# EAGLE design VGA Breakout Board (EAGLE 9.2.2)
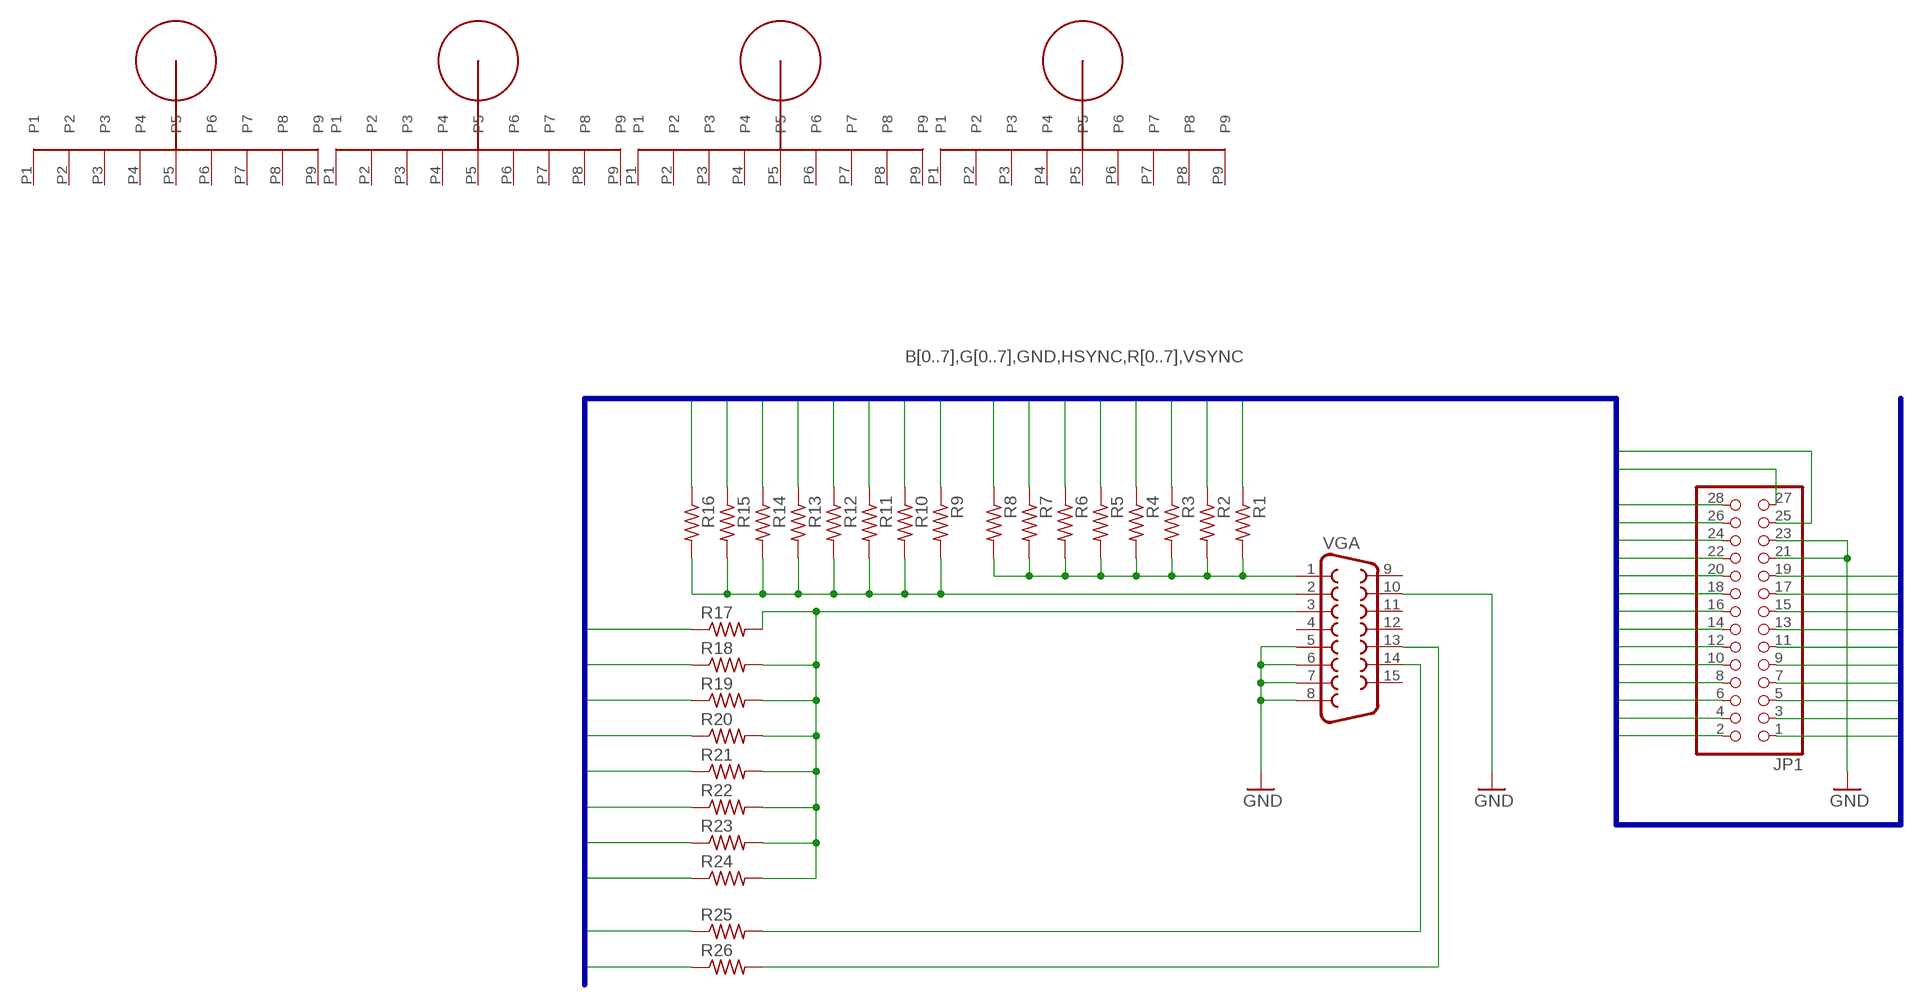
[diagram p0: schematic, sheet 1]

## Parts
JP1  PINHD-2X14  [2X14]
R1  R-US_0207/10  [0207/10]
R2  R-US_0207/10  [0207/10]
R3  R-US_0207/10  [0207/10]
R4  R-US_0207/10  [0207/10]
R5  R-US_0207/10  [0207/10]
R6  R-US_0207/10  [0207/10]
R7  R-US_0207/10  [0207/10]
R8  R-US_0207/10  [0207/10]
R9  R-US_0207/10  [0207/10]
R10  R-US_0207/10  [0207/10]
R11  R-US_0207/10  [0207/10]
R12  R-US_0207/10  [0207/10]
R13  R-US_0207/10  [0207/10]
R14  R-US_0207/10  [0207/10]
R15  R-US_0207/10  [0207/10]
R16  R-US_0207/10  [0207/10]
R17  R-US_0207/10  [0207/10]
R18  R-US_0207/10  [0207/10]
R19  R-US_0207/10  [0207/10]
R20  R-US_0207/10  [0207/10]
R21  R-US_0207/10  [0207/10]
R22  R-US_0207/10  [0207/10]
R23  R-US_0207/10  [0207/10]
R24  R-US_0207/10  [0207/10]
R25  R-US_0207/10  [0207/10]
R26  R-US_0207/10  [0207/10]
U$1  STANDOFF  [STANDOFF]
U$2  STANDOFF  [STANDOFF]
U$3  STANDOFF  [STANDOFF]
U$4  STANDOFF  [STANDOFF]
VGA  F15HDH  [HDF15H]

## Nets
B0: JP1.18 R17.1
B1: JP1.20 R18.1
B2: JP1.22 R19.1
B3: JP1.24 R20.1
B4: JP1.26 R21.1
B5: JP1.28 R22.1
B6: JP1.27 R23.1
B7: JP1.25 R24.1
G0: JP1.1 R9.1
G1: JP1.3 R10.1
G2: JP1.5 R11.1
G3: JP1.7 R12.1
G4: JP1.9 R13.1
G5: JP1.11 R14.1
G6: JP1.13 R15.1
G7: JP1.15 R16.1
GND: JP1.21 JP1.23 VGA.5 VGA.6 VGA.7 VGA.8 VGA.10
HSYNC: JP1.17 R26.1
N$1: R1.2 R2.2 R3.2 R4.2 R5.2 R6.2 R7.2 R8.2 VGA.1
N$2: R9.2 R10.2 R11.2 R12.2 R13.2 R14.2 R15.2 R16.2 VGA.2
N$3: R17.2 R18.2 R19.2 R20.2 R21.2 R22.2 R23.2 R24.2 VGA.3
N$4: R25.2 VGA.14
N$5: R26.2 VGA.13
R0: JP1.16 R1.1
R1: JP1.14 R2.1
R2: JP1.12 R3.1
R3: JP1.10 R4.1
R4: JP1.8 R5.1
R5: JP1.6 R6.1
R6: JP1.4 R7.1
R7: JP1.2 R8.1
VSYNC: JP1.19 R25.1
Unconnected: U$1.P1 U$1.P2 U$1.P3 U$1.P4 U$1.P5 U$1.P6 U$1.P7 U$1.P8 U$1.P9 U$2.P1 U$2.P2 U$2.P3 U$2.P4 U$2.P5 U$2.P6 U$2.P7 U$2.P8 U$2.P9 U$3.P1 U$3.P2 U$3.P3 U$3.P4 U$3.P5 U$3.P6 U$3.P7 U$3.P8 U$3.P9 U$4.P1 U$4.P2 U$4.P3 U$4.P4 U$4.P5 U$4.P6 U$4.P7 U$4.P8 U$4.P9 VGA.4 VGA.9 VGA.11 VGA.12 VGA.15

## Buses
B[0..7],G[0..7],GND,HSYNC,R[0..7],VSYNC

## Library data of the parts
JP1 = adafruit:PINHD-2X14: PIN HEADER
R1-R26 = adafruit:R-US_: RESISTOR, American symbol
U$1-U$4 = standoff:STANDOFF
VGA = adafruit:F15: SUB-D HDH is also known as a 'right angle VGA' connector

## Board
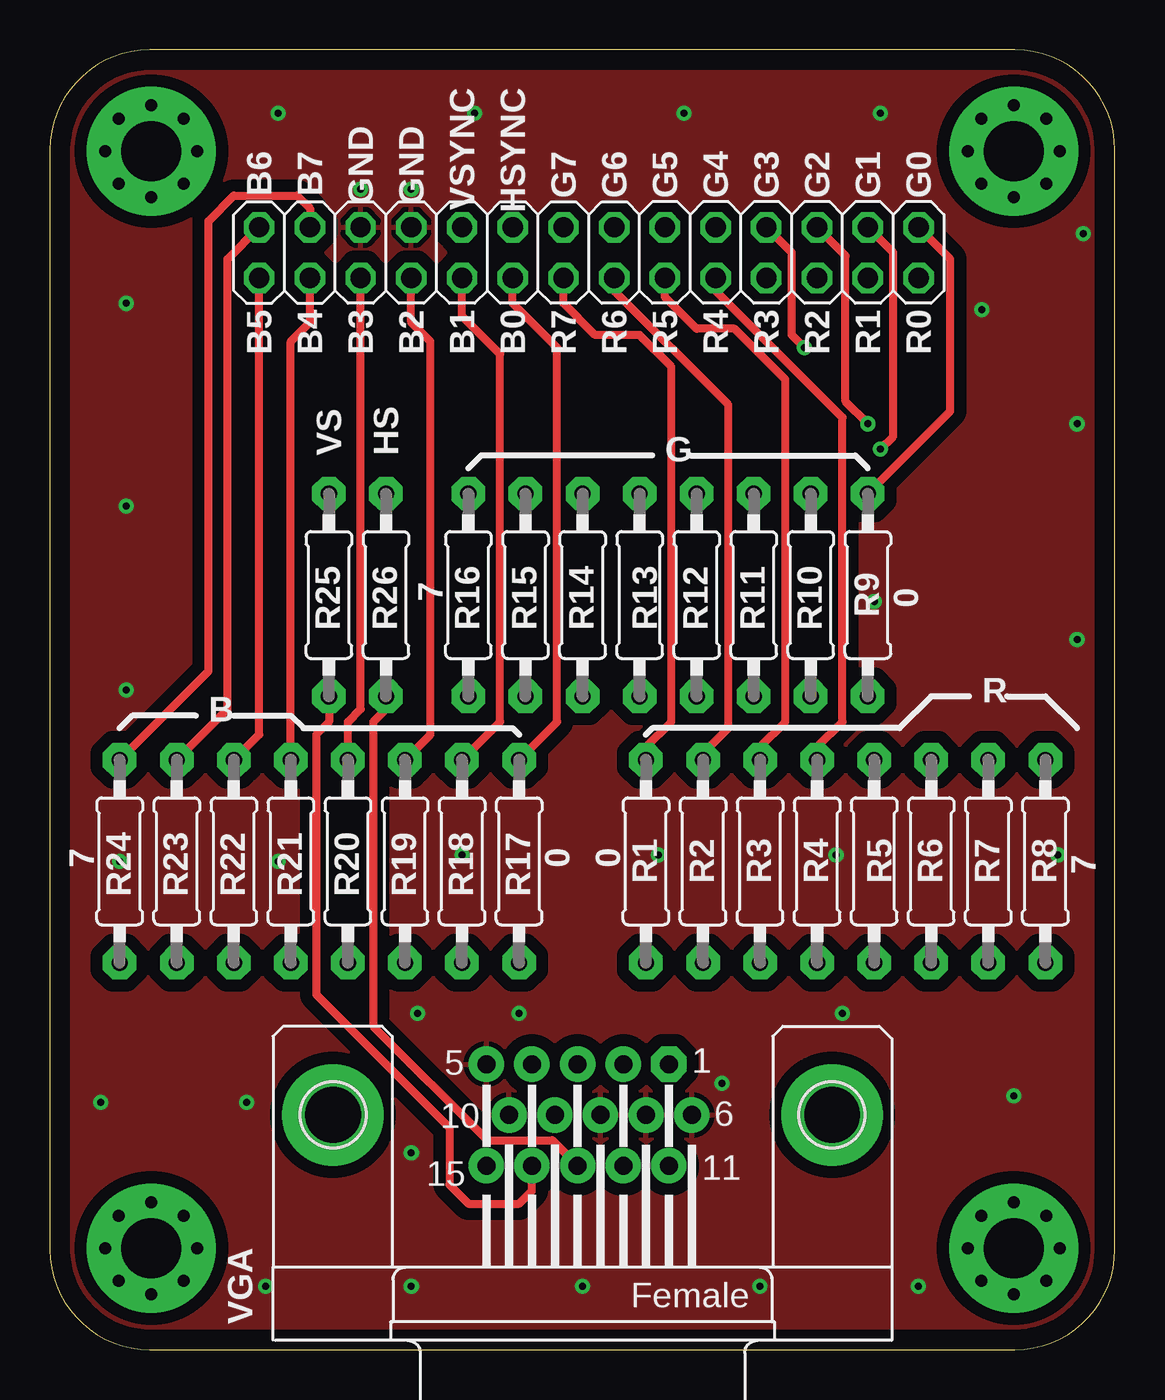
[diagram p1: board, top side]
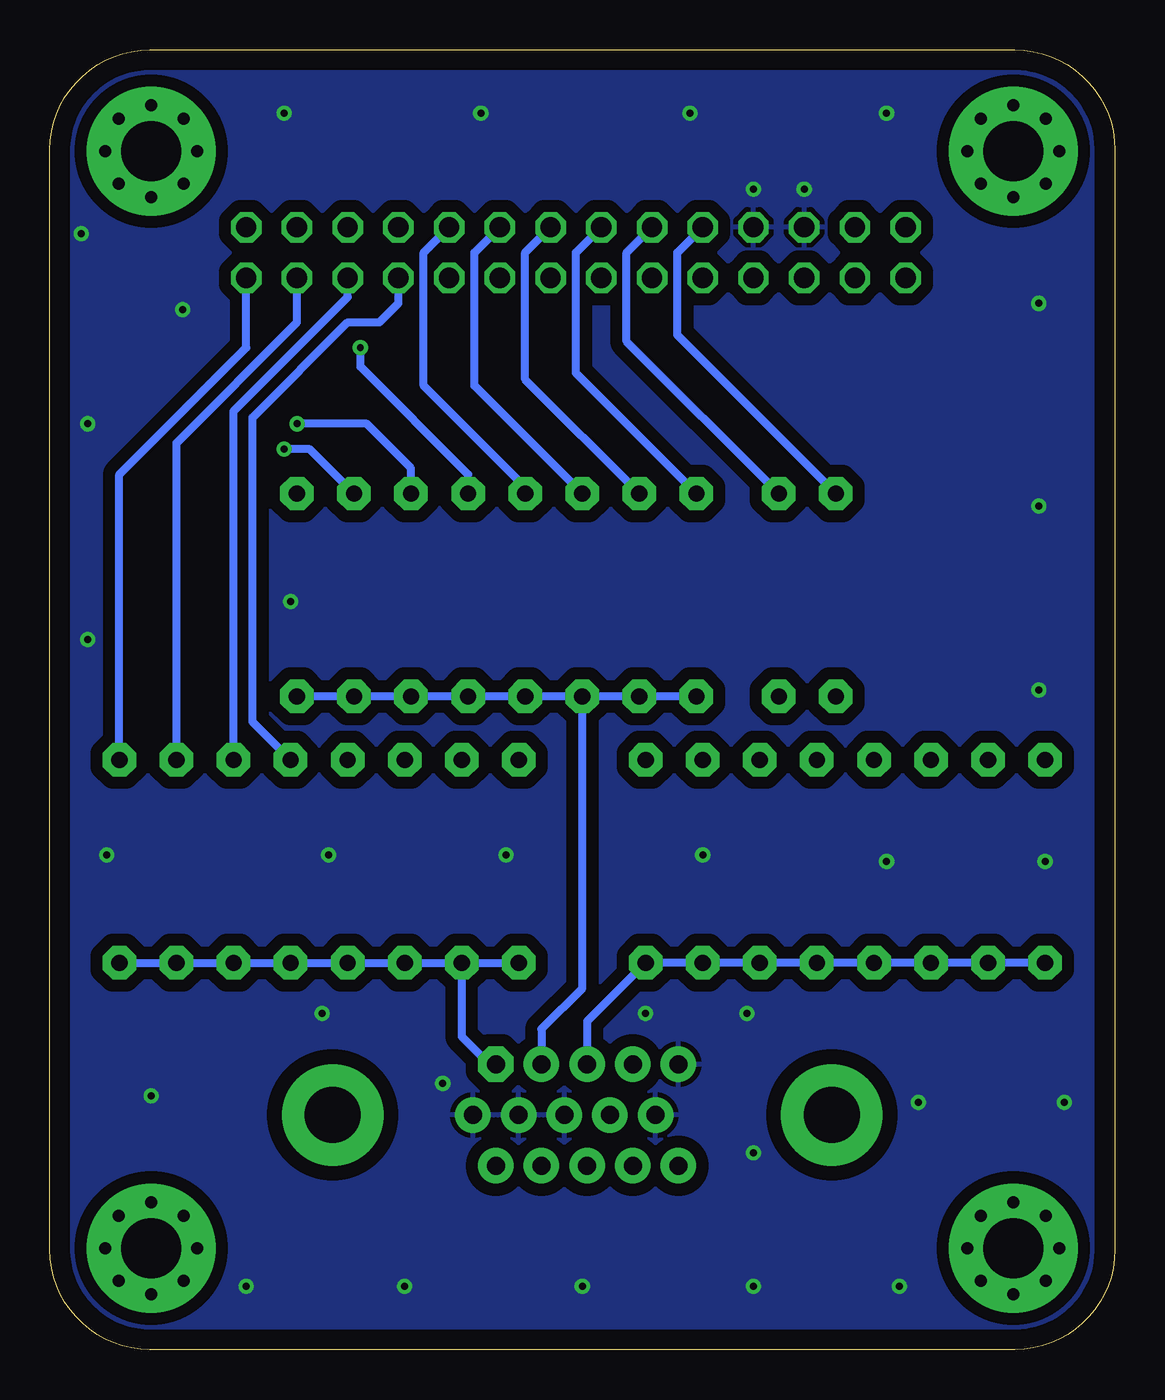
[diagram p2: board, bottom side, seen from below]

Size 53.33 x 65.08 mm. Coordinates in mm from the lower left corner, seen from the top.
Outline: 53.33,5 53.33,60.08 arc90 48.33,65.08 5,65.08 arc90 0,60.08 0,5 arc90 5,0 48.33,0 arc90 53.33,5
Copper layers (1*16): Top 0.035mm / dielectric 1.5mm / Bottom 0.035mm
Design rules "default *": minimum track width 6mil, minimum drill 0.35mm, track to track 6mil, track to pad 6mil, pad to pad 6mil, via to via 6mil, smd to smd 6mil, copper to edge 40mil, drill to drill 6mil, minimum pad ring 10mil, minimum via ring 8mil, stop-mask expansion 4mil, vias tented up to drill 14mil, thermal gap 10mil

### Footprints (pad centres in the part's own frame; a part is rotated, then mirrored left to right if it is on the bottom)
2X14 = drill 1.016 octagon: 1 -16.51,-1.27; 2 -16.51,1.27; 3 -13.97,-1.27; 4 -13.97,1.27; 5 -11.43,-1.27; 6 -11.43,1.27; 7 -8.89,-1.27; 8 -8.89,1.27; 9 -6.35,-1.27; 10 -6.35,1.27; 11 -3.81,-1.27; 12 -3.81,1.27; 13 -1.27,-1.27; 14 -1.27,1.27; 15 1.27,-1.27; 16 1.27,1.27; 17 3.81,-1.27; 18 3.81,1.27; 19 6.35,-1.27; 20 6.35,1.27; 21 8.89,-1.27; 22 8.89,1.27; 23 11.43,-1.27; 24 11.43,1.27; 25 13.97,-1.27; 26 13.97,1.27; 27 16.51,-1.27; 28 16.51,1.27
0207/10 = drill 0.813 pad 1.676 octagon: 1 -5.08,0; 2 5.08,0
STANDOFF = drill 3 pad 6.452: P1 0,0 | drill 0.6: P2 2.3,0; P3 1.626,1.626; P4 0,2.3; P5 -1.626,1.626; P6 -2.3,0; P7 -1.626,-1.626; P8 0,-2.3; P9 1.626,-1.626
HDF15H = drill 0.9 pad 1.778 octagon: 1 4.329,2.54 | drill 0.9 pad 1.778: 2 2.043,2.54; 3 -0.243,2.54; 4 -2.529,2.54; 5 -4.815,2.54; 6 5.472,0; 7 3.186,0; 8 0.9,0; 9 -1.386,0; 10 -3.672,0; 11 4.329,-2.54; 12 2.043,-2.54; 13 -0.243,-2.54; 14 -2.529,-2.54; 15 -4.815,-2.54 | drill 2.8 pad 5.08: P$1 -12.5,0; P$2 12.5,0

### Placement (x,y rotation side)
JP1  26.99,54.93 180 top
R1  29.84,24.45 270 top
R2  32.7,24.45 270 top
R3  35.56,24.45 270 top
R4  38.42,24.45 270 top
R5  41.27,24.45 270 top
R6  44.13,24.45 270 top
R7  46.99,24.45 270 top
R8  49.85,24.45 270 top
R9  40.96,37.78 270 top
R10  38.1,37.78 270 top
R11  35.24,37.78 270 top
R12  32.38,37.78 270 top
R13  29.53,37.78 270 top
R14  26.67,37.78 270 top
R15  23.81,37.78 270 top
R16  20.95,37.78 270 top
R17  23.5,24.45 270 top
R18  20.64,24.45 270 top
R19  17.78,24.45 270 top
R20  14.92,24.45 270 top
R21  12.06,24.45 270 top
R22  9.21,24.45 270 top
R23  6.35,24.45 270 top
R24  3.49,24.45 270 top
R25  13.97,37.78 270 top
R26  16.83,37.78 270 top
U$1  5.08,5.08 0 top
U$2  48.26,5.08 0 top
U$3  48.26,60.01 0 top
U$4  5.08,60.01 0 top
VGA  26.67,11.75 0 top

### Tracks (layer width: path | path; a pad name or v marks a point on that pad's centre or on a via)
B0
  Top 0.406: R17.1 25.4,31.43 25.4,50.16 23.18,52.39 JP1.18
B1
  Top 0.406: R18.1 22.54,31.43 22.54,49.85 20.64,51.75 JP1.20
B2
  Top 0.406: R19.1 19.05,30.8 19.05,50.48 18.1,51.44 JP1.22
B3
  Top 0.406: R20.1 14.92,31.43 15.56,32.07 JP1.24
B4
  Top 0.406: R21.1 12.06,50.48 13.02,51.44 JP1.26
B5
  Top 0.406: R22.1 10.48,30.8 JP1.28
B6
  Top 0.406: R23.1 8.89,32.07 8.89,54.61 JP1.27
B7
  Top 0.406: R24.1 7.94,33.97 7.94,56.52 9.21,57.78 12.38,57.78 13.02,57.15 JP1.25
G0
  Top 0.406: R9.1 45.09,46.99 45.09,54.61 JP1.1
G1  (via drill 0.35)
  Top 0.406: v41.59,45.09 42.23,45.72 42.23,54.93 JP1.3
  Bottom 0.406: R10.1 40.32,45.09 v41.59,45.09
G2  (via drill 0.35)
  Top 0.406: v40.96,46.35 39.84,47.47 39.84,54.77 JP1.5
  Bottom 0.406: R11.1 35.24,44.13 37.47,46.35 v40.96,46.35
G3  (via drill 0.35)
  Top 0.406: v37.78,50.16 37.15,50.8 37.15,54.93 JP1.7
  Bottom 0.406: R12.1 32.38,43.81 37.78,49.21 v37.78,50.16
G4
  Bottom 0.406: R13.1 29.53,43.18 34.61,48.26 34.61,54.93 JP1.9
G5
  Bottom 0.406: R14.1 32.07,48.26 32.07,54.93 JP1.11
G6
  Bottom 0.406: R15.1 29.53,48.58 29.53,54.93 JP1.13
G7
  Bottom 0.406: R16.1 26.99,48.9 26.99,54.93 JP1.15
GND  (via drill 0.35)
  other vias: 18.1,58.1 51.75,55.88 39.37,24.77 41.59,61.91 46.67,52.07 50.48,24.77 31.75,61.91 15.56,58.1 51.44,35.56 21.27,61.91 11.43,61.91 51.44,46.35 11.43,24.45 3.49,24.45 3.81,52.39 3.81,42.23 3.81,33.02 2.54,12.38 9.84,12.38 23.5,16.83 18.1,3.17 18.1,9.84 10.79,3.17 33.66,13.34 35.56,3.17 26.67,3.17 18.41,16.83 30.48,24.77 20.64,24.77 48.26,12.7 43.5,3.17 39.69,16.83 41.27,37.47
  pour Bottom (isolate 0.61): 0,65.09 53.34,65.09 53.34,0 0,0 0,12.06
  pour Top (isolate 0.61): 0,65.09 53.34,65.09 53.34,0 0,0
HSYNC
  Bottom 0.406: R26.1 24.45,50.48 24.45,54.93 JP1.17
N$1
  Bottom 0.406: R8.2 R7.2 R6.2 R5.2 R4.2 R3.2 R2.2 | R2.2 R1.2 | R2.2 32.7,15.67 31.32,14.29 VGA.1
N$2
  Bottom 0.406: R16.2 R15.2 R14.2 | R14.2 R13.2 R12.2 R11.2 R10.2 R9.2 | R14.2 26.67,18.1 28.71,16.05 VGA.2
N$3
  Bottom 0.406: R24.2 R23.2 R22.2 R21.2 R20.2 R19.2 R18.2 R17.2 26.43,16.44 VGA.3
N$4
  Top 0.406: R25.2 13.97,31.43 13.34,30.8 13.34,17.78 20,11.11 20,8.26 20.95,7.3 23.5,7.3 24.14,7.95 VGA.14
N$5
  Top 0.406: R26.2 16.83,32.07 16.19,31.43 16.19,16.19 21.91,10.48 25.16,10.48 VGA.13
R0
  Top 0.406: R1.1 29.84,30.16 31.11,31.43 31.11,49.21 29.53,50.8 27.3,50.8 25.72,52.39 JP1.16
R1
  Top 0.406: R2.1 32.7,29.84 33.97,31.11 33.97,47.31 28.26,53.02 JP1.14
R2
  Top 0.406: R3.1 35.56,30.16 36.83,31.43 36.83,48.58 34.29,51.12 32.38,51.12 30.8,52.7 JP1.12
R3
  Top 0.406: R4.1 38.42,30.16 39.69,31.43 39.69,46.67 33.34,53.02 JP1.10
R4
  Bottom 0.406: R5.1 43.18,31.43 43.18,46.67 38.42,51.44 36.83,51.44 35.88,52.39 JP1.8
R5
  Bottom 0.406: R6.1 44.13,46.99 38.42,52.7 JP1.6
R6
  Bottom 0.406: R7.1 46.99,45.4 40.96,51.44 JP1.4
R7
  Bottom 0.406: R8.1 49.85,43.81 43.5,50.16 JP1.2
VSYNC
  Bottom 0.406: R25.1 21.91,50.8 21.91,54.93 JP1.19

### Text on the board
tPlace: VSYNC | HSYNC | GND | GND | B6 | B7 | G7 | G6 | G5 | G4 | G3 | G2 | G1 | G0 | B5 | B4 | B3 | B2 | B1 | B0 | R7 | R6 | R5 | R4 | R3 | R2 | R1 | R0 | VS | HS | G | 7 | 0 | R | B | 7 | 0 | 0 | 7